# Altium project PWM Remapper - R3.PrjPcb
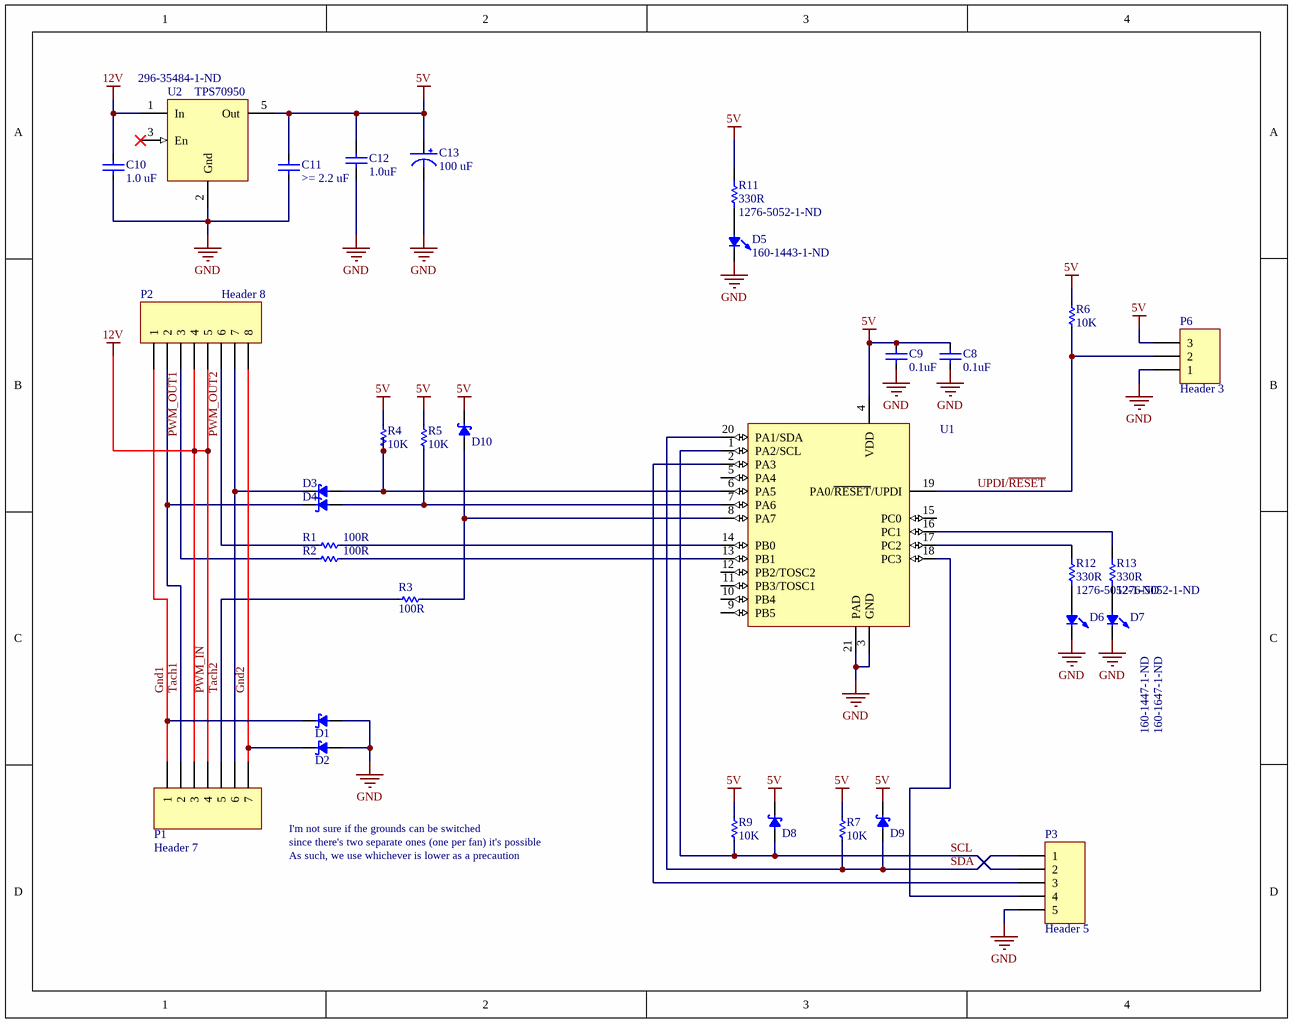
[diagram p0: Main.SchDoc]
1 sheet, 33 parts. Net scope: global (net labels, ports and power ports of the same name join across sheets).
Board file: Main.PcbDoc

## Sheet Main.SchDoc
size A

### Parts
C8  value 0.1uF  [0603C]  (hidden comment: Cap)
C9  value 0.1uF  [0603C]  (hidden comment: Cap)
C10  value 1.0 uF  [1206C]  (hidden comment: Cap)
C11  value >= 2.2 uF  [1206C]  (hidden comment: Cap)
C12  value 1.0uF  [1206C]  (hidden comment: Cap Semi)
C13  100 uF  [B]
D1  Schottky Diode  [SOD-323]  (value not drawn)
D2  Schottky Diode  [SOD-323]  (value not drawn)
D3  Schottky Diode  [SOD-323]  (value not drawn)
D4  Schottky Diode  [SOD-323]  (value not drawn)
D5  Supplier Part Number 1: 160-1443-1-ND  [0603 SMT LED]  (hidden comment: LED0)
D6  Supplier Part Number 1: 160-1447-1-ND  [0603 SMT LED]  (hidden comment: LED0)
D7  Supplier Part Number 1: 160-1647-1-ND  [0603 SMT LED]  (hidden comment: LED0)
D8  Schottky Diode  [SOD-323]  (value not drawn)
D9  Schottky Diode  [SOD-323]  (value not drawn)
D10  Schottky Diode  [SOD-323]  (value not drawn)
P1  Header 7  [HDR1X7]
P2  Header 8  [HDR1X8]
P3  Header 5  [Molex 5055670571]
P6  Header 3  [HDR1X3]
R1  value 100R  [0603R]  (hidden comment: Res Semi Small)
R2  value 100R  [0603R]  (hidden comment: Res Semi Small)
R3  value 100R  [0603R]  (hidden comment: Res Semi Small)
R4  value 10K  [0603R]  (hidden comment: Res Semi Small)
R5  value 10K  [0603R]  (hidden comment: Res Semi Small)
R6  value 10K  [0603R]  (hidden comment: Res Semi Small)
R7  value 10K  [0603R]  (hidden comment: Res Semi Small)
R9  value 10K  [0603R]  (hidden comment: Res Semi Small)
R11  value 330R  Supplier Part Number 1: 1276-5052-1-ND  [0603R]  (hidden comment: Res Semi)
R12  value 330R  Supplier Part Number 1: 1276-5052-1-ND  [0603R]  (hidden comment: Res Semi)
R13  value 330R  Supplier Part Number 1: 1276-5052-1-ND  [0603R]  (hidden comment: Res Semi)
U1  ATTiny1616-MFR  [QFN40P300X300X90_HS-21N]  (value not drawn)
U2  TPS70950  Supplier Part Number 1: 296-35484-1-ND  [SOT23-5AN]

### Nets
5V: C8.2 C9.2 C11.2 C12.2 C13.1 D8.1 D9.1 D10.1 P6.3 R4.2 R5.2 R6.2 R7.2 R9.2 R11.2 U1.4(VDD) U2.5(Out)
GND: C8.1 C9.1 C10.1 C11.1 C12.1 C13.2 D1.2 D2.2 D5.2 D6.2 D7.2 P3.5 P6.1 U1.3(GND) U1.21(PAD) U2.2(Gnd)
PWM_IN: C10.2 P1.3 P1.4 P2.4 P2.5 U2.1(In)  [also labelled 12V]
Gnd1: D1.1 P1.1 P2.1
Gnd2: D2.1 P1.7 P2.8
PWM_OUT1: P2.3 R2.1
PWM_OUT2: P2.6 R1.1
SCL: D8.2 P3.2 R9.1 U1.1(PA2/SCL)
SDA: D9.2 P3.1 R7.1 U1.20(PA1/SDA)
Tach1: D4.1 P1.2 P2.2
Tach2: P1.5 R3.1
UPDI/~{RESET}: P6.2 R6.1 U1.19(PA0/~{RESET}/UPDI)
NetD3_1: D3.1 P1.6 P2.7
NetD3_2: D3.2 R4.1 U1.6(PA5)
NetD4_2: D4.2 R5.1 U1.7(PA6)
NetD5_1: D5.1 R11.1
NetD6_1: D6.1 R12.1
NetD7_1: D7.1 R13.1
NetD10_2: D10.2 R3.2 U1.8(PA7)
NetP3_3: P3.3 U1.2(PA3)
NetP3_4: P3.4 U1.18(PC3)
NetR1_2: R1.2 U1.14(PB0)
NetR2_2: R2.2 U1.13(PB1)
NetR12_2: R12.2 U1.17(PC2)
NetR13_2: R13.2 U1.16(PC1)

Not connected (* = marked no-connect by the designer): U1 5(PA4) 9(PB5) 10(PB4) 11(PB3/TOSC1) 12(PB2/TOSC2) 15(PC0); U2 3(En)*

### Notes on the sheet
- I'm not sure if the grounds can be switched
- since there's two separate ones (one per fan) it's possible
- As such, we use whichever is lower as a precaution

### Library data of the parts
C8-C11 = Cap: Capacitor
  C8 C9: Supplier Part Number 1: 445-1316-1-ND; Supplier 1: Digi-Key; Cost: derp
  C10 C11: Published: 8-Jun-2000; LatestRevisionDate: 17-Jul-2002; LatestRevisionNote: Re-released for DXP Platform.; PackageReference: RAD-0.3; Publisher: Altium Limited
C12 = Cap Semi: Capacitor (Semiconductor SIM Model); Published: 8-Jun-2000; LatestRevisionDate: 17-Jul-2002; LatestRevisionNote: Re-released for DXP Platform.; PackageReference: C1206; Publisher: Altium Limited
C13 = 100 uf SMT Panasonic Cap
D5-D7 = LED0: T 1 3/4 LED; Published: 8-Jun-2000; LatestRevisionDate: 08-Jul-2005; LatestRevisionNote: Mech Layer 1 removed.; PackageReference: LED-0; Publisher: Altium Limited; Supplier 1: Digi-Key
P1 = Header 7: Header, 7-Pin; LatestRevisionDate: 17-Jul-2002; LatestRevisionNote: Re-released for DXP Platform.; Publisher: Altium Limited
P2 = Header 8: Header, 8-Pin; LatestRevisionDate: 17-Jul-2002; LatestRevisionNote: Re-released for DXP Platform.; Publisher: Altium Limited
P3 = Header 5: Header, 5-Pin; LatestRevisionDate: 17-Jul-2002; LatestRevisionNote: Re-released for DXP Platform.; Publisher: Altium Limited
P6 = Header 3: Header, 3-Pin; LatestRevisionDate: 17-Jul-2002; LatestRevisionNote: Re-released for DXP Platform.; Publisher: Altium Limited
R1-R7 R9 = Res Semi Small: Semiconductor Resistor; Published: 8-Jun-2000; LatestRevisionDate: 17-Jul-2002; LatestRevisionNote: Re-released for DXP Platform.; PackageReference: AXIAL-0.5; Publisher: Altium Limited
R11-R13 = Res Semi: SMT Resistor; Published: 8-Jun-2000; LatestRevisionDate: 17-Jul-2002; LatestRevisionNote: Re-released for DXP Platform.; PackageReference: AXIAL-0.5; Publisher: Altium Limited; Supplier 1: Digi-Key
U2 = TPS709XX: 150-mA, 30-V, Ultra-Low IQ, Wide Input Low-Dropout Regulator with Reverse Current Protection; DKPN: 296-35483-1-ND (3.3V Version); Supplier 1: Digi-Key